# Altium schematic sheet Sheet1.SchDoc
size A3; SheetNumber: 1; SheetTotal: 1
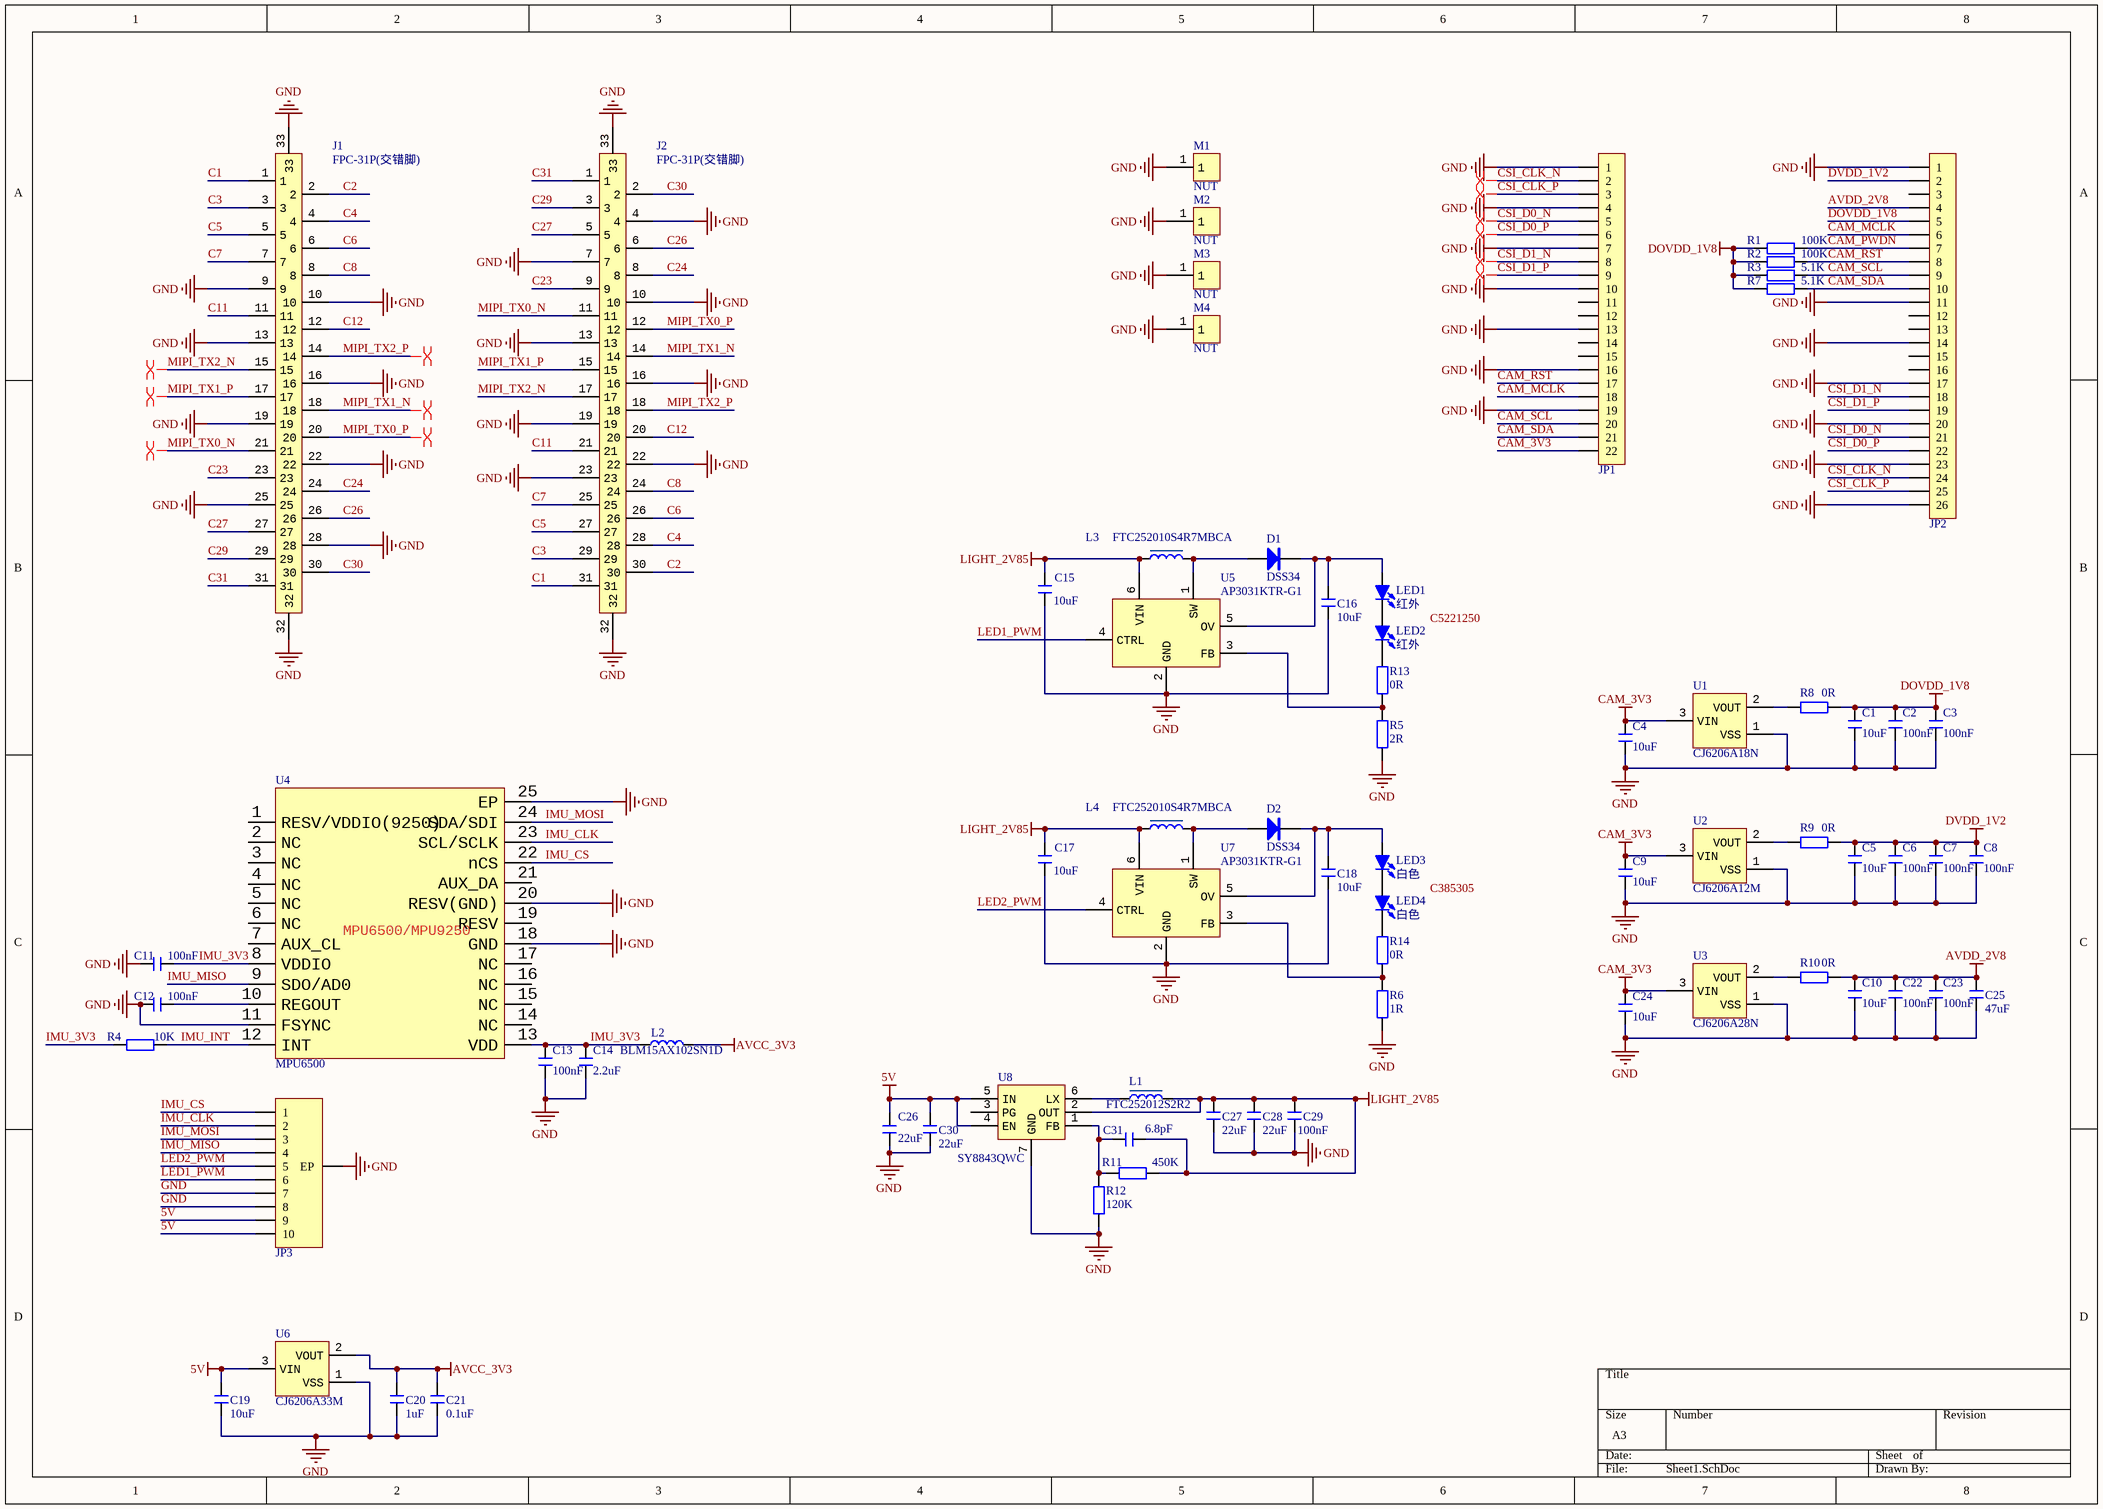
[diagram p0: Sheet1.SchDoc]

## Parts
C1  10uF  [C 0402_L]
C2  100nF  [C 0402_L]
C3  100nF  [C 0402_L]
C4  10uF  [C 0402_L]
C5  10uF  [C 0402_L]
C6  100nF  [C 0402_L]
C7  100nF  [C 0402_L]
C8  100nF  [C 0402_L]
C9  10uF  [C 0402_L]
C10  10uF  [C 0402_L]
C11  100nF  [C 0402_L]
C12  100nF  [C 0402_L]
C13  100nF  [C 0402_L]
C14  2.2uF  [C 0402_L]
C15  10uF  [C 0603_L]
C16  10uF  [C 0603_L]
C17  10uF  [C 0603_L]
C18  10uF  [C 0603_L]
C19  10uF  [C 0603_L]
C20  1uF  [C 0402_L]
C21  0.1uF  [C 0402_L]
C22  100nF  [C 0402_L]
C23  100nF  [C 0402_L]
C24  10uF  [C 0402_L]
C25  47uF  [C 0603_L]
C26  22uF  [C 0603_L]
C27  22uF  [C 0603_L]
C28  22uF  [C 0603_L]
C29  100nF  [C 0402_L]
C30  22uF  [C 0603_L]
C31  6.8pF  [C 0402_L]
D1  DSS34  [SOD-123FL]
D2  DSS34  [SOD-123FL]
J1  FPC-31P(交错脚)  [FPC 1H-WS-31P]
J2  FPC-31P(交错脚)  [FPC 1H-WS-31P]
JP1  FPC1.0-22P  [FPC0.5 2H-WS-22P]  (value not drawn)
JP2  FPC1.0-26P  [FPC0.5 2H-WS-26P]  (value not drawn)
JP3  FPC1.0-10P  [FPC0.5 1H-WS-10P]  (value not drawn)
L1  FTC252012S2R2  [252012]
L2  BLM15AX102SN1D  [L 0402]
L3  FTC252010S4R7MBCA  [252012]
L4  FTC252010S4R7MBCA  [252012]
LED1  红外  [LED 3528-2Pin]
LED2  红外  [LED 3528-2Pin]
LED3  白色  [LED 3528-2Pin]
LED4  白色  [LED 3528-2Pin]
M1  NUT  [SMT-NUT-M1610]
M2  NUT  [SMT-NUT-M1610]
M3  NUT  [SMT-NUT-M1610]
M4  NUT  [SMT-NUT-M1610]
R1  100K  [R 0402_L]
R2  100K  [R 0402_L]
R3  5.1K  [R 0402_L]
R4  10K  [R 0402_L]
R5  2R  [R 0603_L]
R6  1R  [R 0603_L]
R7  5.1K  [R 0402_L]
R8  0R  [R 0402_L]
R9  0R  [R 0402_L]
R10  0R  [R 0402_L]
R11  450K  [R 0402_L]
R12  120K  [R 0402_L]
R13  0R  [R 0603_L]
R14  0R  [R 0603_L]
U1  CJ6206A18N  [SOT23-3L]
U2  CJ6206A12M  [SOT23-3L]
U3  CJ6206A28N  [SOT23-3L]
U4  MPU6500  [QFN24 3X3]
U5  AP3031KTR-G1  [SOT23-6L]
U6  CJ6206A33M  [SOT23-3L]
U7  AP3031KTR-G1  [SOT23-6L]
U8  SY8843QWC  [QFN7 1.5X1.5]

## Nets
5V: C19.2 C26.2 C30.2 JP3.9 JP3.10 U6.3(VIN) U8.4(EN) U8.5(IN)
AVCC_3V3: C20.2 C21.2 L2.2 U6.2(VOUT)
AVDD_2V8: C10.2 C22.2 C23.2 C25.2 JP2.4 R10.2
CAM_3V3: C4.2 C9.2 C24.2 JP1.22 U1.3(VIN) U2.3(VIN) U3.3(VIN)
DOVDD_1V8: C1.2 C2.2 C3.2 JP2.5 R1.1 R2.1 R3.1 R7.1 R8.2
DVDD_1V2: C5.2 C6.2 C7.2 C8.2 JP2.2 R9.2
GND: C1.1 C2.1 C3.1 C4.1 C5.1 C6.1 C7.1 C8.1 C9.1 C10.1 C11.2 C12.2 C13.1 C14.1 C15.1 C16.1 C17.1 C18.1 C19.1 C20.1 C21.1 C22.1 C23.1 C24.1 C25.1 C26.1 C27.1 C28.1 C29.1 C30.1 J1.9 J1.10 J1.13 J1.16 J1.19 J1.22 J1.25 J1.28 J1.32 J1.33 J2.4 J2.7 J2.10 J2.13 J2.16 J2.19 J2.22 J2.23 J2.32 J2.33 JP1.1 JP1.4 JP1.7 JP1.10 JP1.13 JP1.16 JP1.19 JP2.1 JP2.11 JP2.14 JP2.17 JP2.20 JP2.23 JP2.26 JP3.0(EP) JP3.7 JP3.8 M1.1 M2.1 M3.1 M4.1 R5.1 R6.1 R12.2 U1.1(VSS) U2.1(VSS) U3.1(VSS) U4.11(FSYNC) U4.18(GND) U4.20(RESV(GND)) U4.25(EP) U5.2(GND) U6.1(VSS) U7.2(GND) U8.7(GND)
LIGHT_2V85: C15.2 C17.2 C27.2 C28.2 C29.2 C31.1 L1.2 L3.1 L4.1 R11.1 U5.6(VIN) U7.6(VIN) U8.2(OUT)
C1: J1.1 J2.31
C2: J1.2 J2.30
C3: J1.3 J2.29
C4: J1.4 J2.28
C5: J1.5 J2.27
C6: J1.6 J2.26
C7: J1.7 J2.25
C8: J1.8 J2.24
C11: J1.11 J2.21
C12: J1.12 J2.20
C23: J1.23 J2.9
C24: J1.24 J2.8
C26: J1.26 J2.6
C27: J1.27 J2.5
C29: J1.29 J2.3
C30: J1.30 J2.2
C31: J1.31 J2.1
CAM_MCLK: JP1.18 JP2.6
CAM_PWDN: JP2.7 R1.2
CAM_RST: JP1.17 JP2.8 R2.2
CAM_SCL: JP1.20 JP2.9 R3.2
CAM_SDA: JP1.21 JP2.10 R7.2
CSI_CLK_N: JP1.2 JP2.24
CSI_CLK_P: JP1.3 JP2.25
CSI_D0_N: JP1.5 JP2.21
CSI_D0_P: JP1.6 JP2.22
CSI_D1_N: JP1.8 JP2.18
CSI_D1_P: JP1.9 JP2.19
IMU_3V3: C11.1 C13.2 C14.2 L2.1 R4.1 U4.8(VDDIO) U4.13(VDD)
IMU_CLK: JP3.2 U4.23(SCL/SCLK)
IMU_CS: JP3.1 U4.22(nCS)
IMU_INT: R4.2 U4.12(INT)
IMU_MISO: JP3.4 U4.9(SDO/AD0)
IMU_MOSI: JP3.3 U4.24(SDA/SDI)
LED1_PWM: JP3.6 U5.4(CTRL)
LED2_PWM: JP3.5 U7.4(CTRL)
MIPI_TX0_N: J1.21 J2.11
MIPI_TX0_P: J1.20 J2.12
MIPI_TX1_N: J1.18 J2.14
MIPI_TX1_P: J1.17 J2.15
MIPI_TX2_N: J1.15 J2.17
MIPI_TX2_P: J1.14 J2.18
NetC12_1: C12.1 U4.10(REGOUT)
NetC16_2: C16.2 D1.1(K) LED1.2(A) U5.5(OV)
NetC18_2: C18.2 D2.1(K) LED3.2(A) U7.5(OV)
NetC31_2: C31.2 R11.2 R12.1 U8.1(FB)
NetD1_2: D1.2(A) L3.2 U5.1(SW)
NetD2_2: D2.2(A) L4.2 U7.1(SW)
NetL1_1: L1.1 U8.6(LX)
NetLED1_1: LED1.1(K) LED2.2(A)
NetLED2_1: LED2.1(K) R13.2
NetLED3_1: LED3.1(K) LED4.2(A)
NetLED4_1: LED4.1(K) R14.2
NetR5_2: R5.2 R13.1 U5.3(FB)
NetR6_2: R6.2 R14.1 U7.3(FB)
NetR8_1: R8.1 U1.2(VOUT)
NetR9_1: R9.1 U2.2(VOUT)
NetR10_1: R10.1 U3.2(VOUT)

Not connected (* = marked no-connect by the designer): JP1 11 12 14 15; JP2 3 12 13 15 16; U4 1(RESV/VDDIO(9250)) 2(NC) 3(NC) 4(NC) 5(NC) 6(NC) 7(AUX_CL) 14(NC) 15(NC) 16(NC) 17(NC) 19(RESV) 21(AUX_DA); U8 3(PG)

## Layout directives
differential pair: CSI_CLK_N, CSI_CLK_P, CSI_D0_N, CSI_D0_P, CSI_D1_N, CSI_D1_P, MIPI_TX0_N, MIPI_TX0_P, MIPI_TX1_N, MIPI_TX1_P, MIPI_TX2_N, MIPI_TX2_P

## Notes on the sheet
- C5221250
- C385305
- (in symbol MPU6500) MPU6500/MPU9250

## Library data of the parts
C1-C31 = C: 无极性贴片电容; 版权归属: 源创客; BOM名称: 无极性贴片电容; 学习资源: www.ooocke.com
D1 D2 = DSS34: 肖特基二极管
J1 J2 = FPC-31P(交错脚): FPC连接器
JP1 = FPC-22P: FPC连接器; 版权归属: 源创客; BOM名称: FPC连接器; 学习资源: www.ooocke.com
JP2 = FPC-26P: FPC连接器; 版权归属: 源创客; BOM名称: FPC连接器; 学习资源: www.ooocke.com
JP3 = FPC-10P: FPC连接器; 版权归属: 源创客; BOM名称: FPC连接器; 学习资源: www.ooocke.com
L1 L3 L4 = L-CD: 贴片功率电感; BOM名称: 功率电感; 版权归属: 源创客; 学习资源: www.ooocke.com
L2 = L: 小功率贴片电感; 版权归属: 源创客; BOM名称: 小功率贴片电感; 学习资源: www.ooocke.com
LED1-LED4 = LED-SMD: 贴片LED; 版权归属: 源创客; BOM名称: 贴片LED; 学习资源: www.ooocke.com
M1-M4 = SMTNUT: SMT表贴螺母
R1-R14 = R: 贴片电阻; 版权归属: 源创客; BOM名称: 贴片电阻; 学习资源: www.ooocke.com
U1-U3 U6 = LN6206PXXX: 三端稳压芯片 / 6V 250mA
U4 = MPU6500: 6轴IMU
U5 U7 = AP3031: LED驱动
U8 = SY8843QWC: DC-DC 1.5M / VIN:2.7~5.5V 3A